# EasyEDA Pro project display_adapter_v3.epro

# Schematic Schematic1
Board Name: Board1; Create Date: 2025-01-31; Page Name: P1; Project Name: New Project_2025-01-31_11-25-02; Schematic Name: Schematic1; Update Date: 2025-01-31; Company: EasyEDA.com; Page Size: A4; Version: V1.0
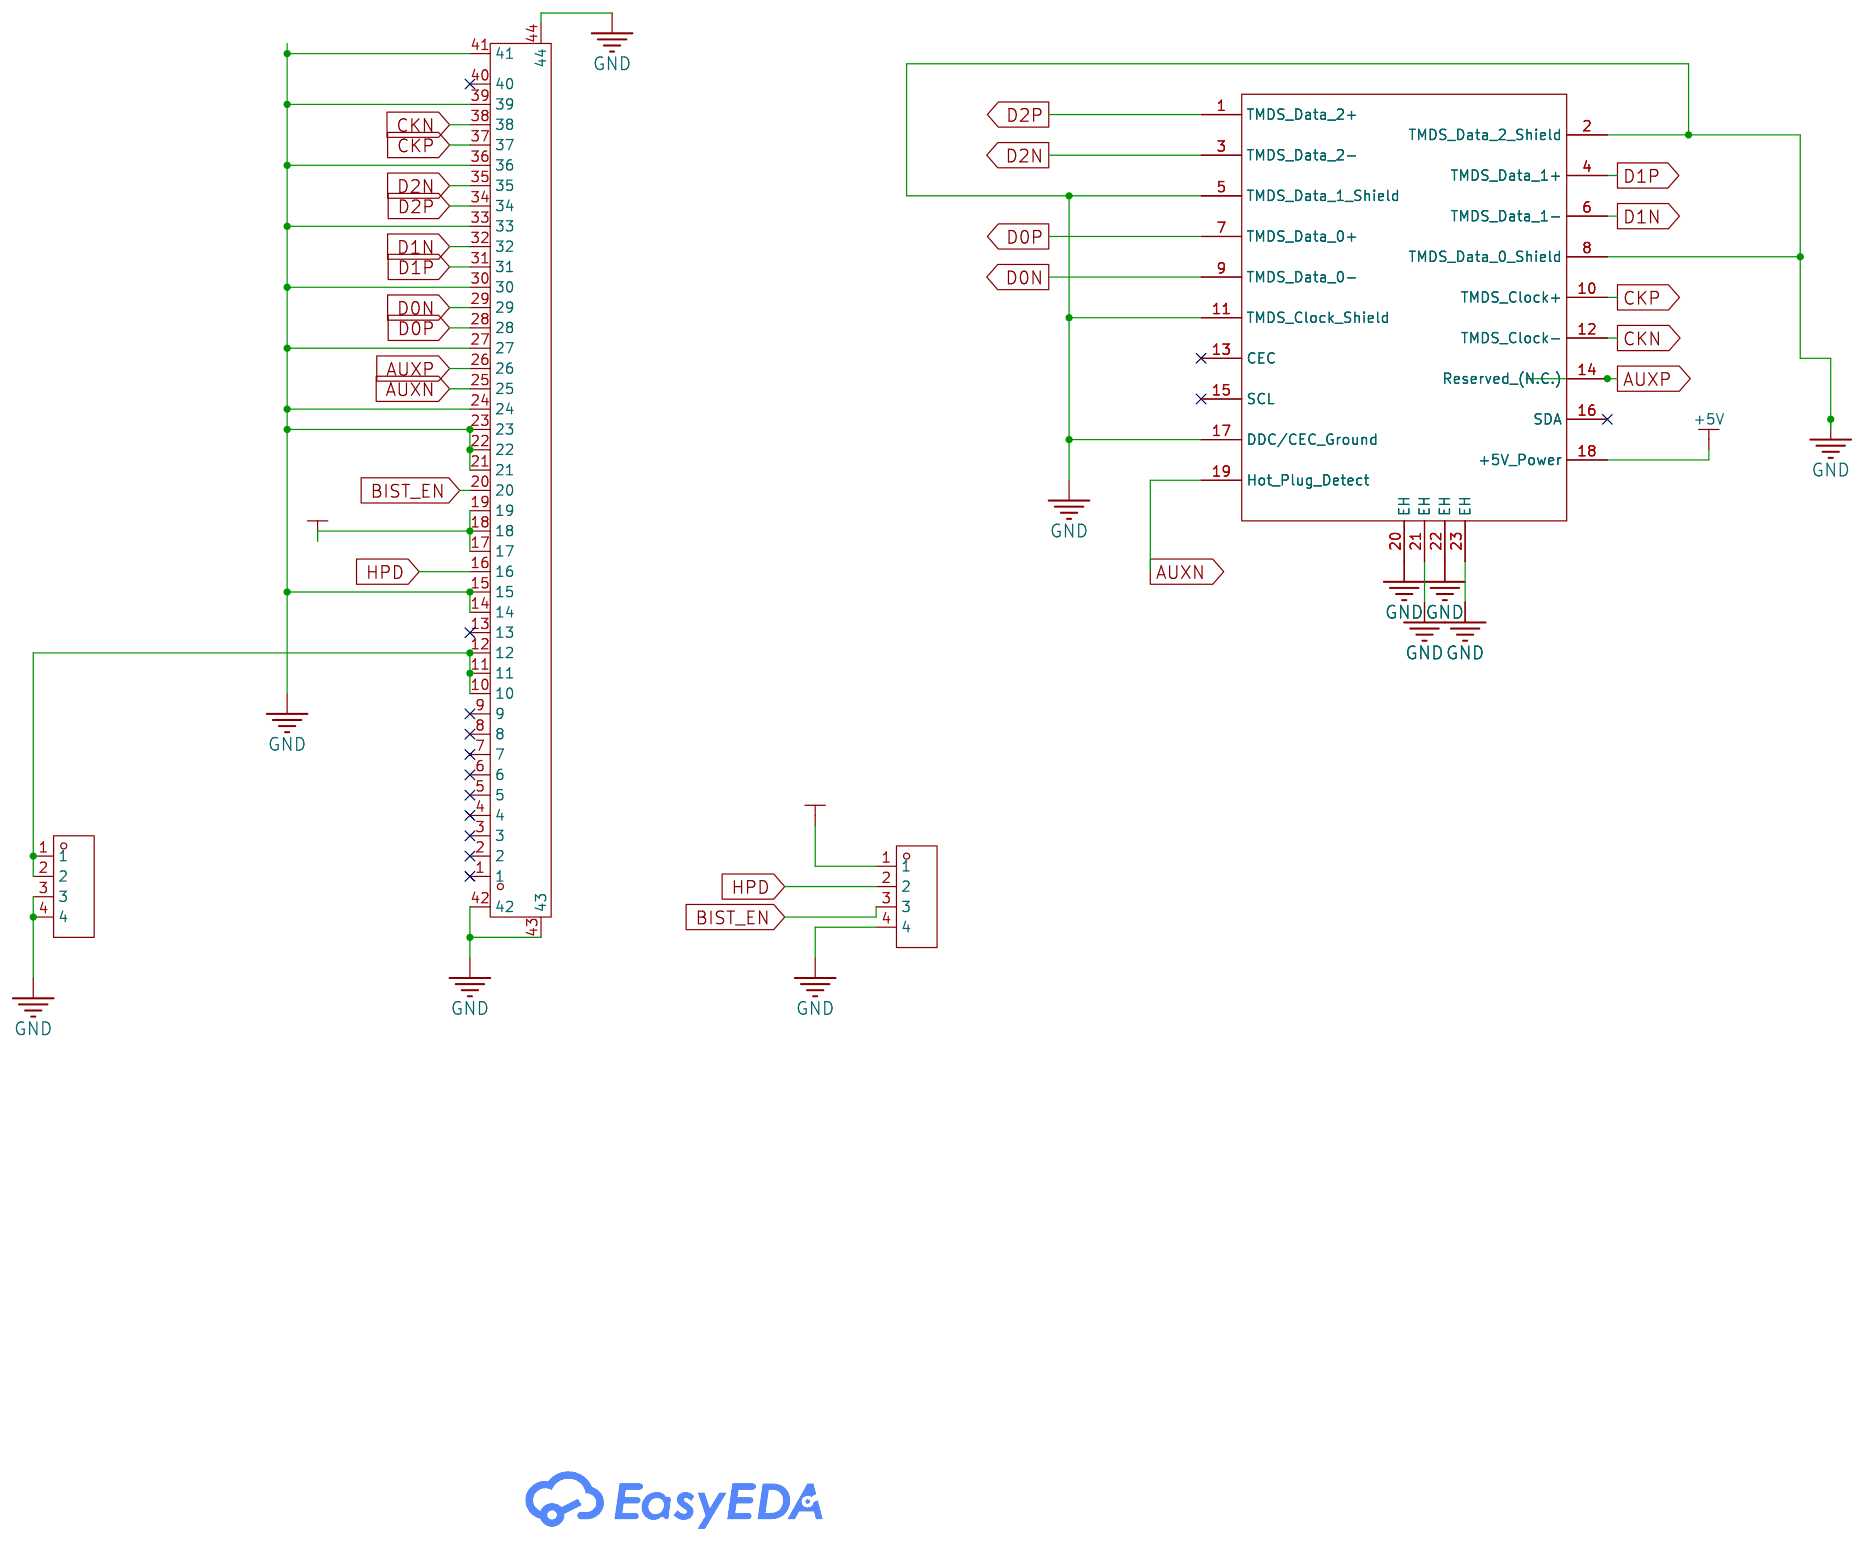
[diagram p0: schematic sheet]

## Parts
CN1  20455-040E-76  [CONN-SMD_40P-P-0.50_20455-040E-76]
CN2  HYC109-HDMIA19-160  [HDMI-SMD_HYC109-HDMIA19-160]
H1  PZ254V-11-04P  [HDR-TH_4P-P2.54-V-M]
H2  PZ254V-11-04P  [HDR-TH_4P-P2.54-V-M]

## Library data of the parts
CN1 = 20455-040E-76: Locking Feature:- Contact Type:Contact,Top Number of Contacts:40P Pitch:0.5mm Mounting Type:Horizontal attachment FFC, FCB Thickness:- FFC, FCB Thickness:- Height Above Board:1mm Contact Material:Phosphor Bronze Contact Plating:Gold Operating Temperature:; LCSC Part Name: 间距:0.5mm P数:40P 上接; Supplier Part: C5160883; Manufacturer: I-PEX(第一精工); Supplier Footprint: SMD,P=0.5mm,卧贴; JLCPCB Part Class: Extended Part; Datasheet: https://atta.szlcsc.com/upload/public/pdf/source/20240130/EF5FF667CA12454350B99650AB73E6AF.pdf; Supplier: LCSC; Contact Type: Contact,Top; Number of Contacts: 40P; Pitch: 0.5mm; Mounting Type: Horizontal attachment; Height Above Board: 1mm; Contact Material: Phosphor Bronze; Contact Plating: Gold; Operating Temperature: -40℃~+85℃
CN2 = HYC109-HDMIA19-160: Connector Type:HDMI-A Gender:公 Number of Pins:19P Mounting Style:夹板 Current Rating (Max):0.5A Rated Voltage (Max):40V Operating Temperature Range:-25℃~+85℃ Operating Temperature Range:-25℃~+85℃; Supplier Part: C711355; Manufacturer: 华宇创; Supplier Footprint: SMD; JLCPCB Part Class: Extended Part; Datasheet: https://atta.szlcsc.com/upload/public/pdf/source/20200812/C711355_A848759657FFB518783CC8260B9E2C54.pdf; Supplier: LCSC; Connector Type: HDMI-A; Gender: 公; Number of Pins: 19P; Mounting Style: 夹板; Current Rating (Max): 0.5A; Rated Voltage (Max): 40V; Operating Temperature Range: -25℃~+85℃
H1 H2 = PZ254V-11-04P: Pin Structure:1x4P Pitch:2.54mm Row Spacing:- Circluar Pins/Square Pins:Square Pins Mounting Type:Straight Number of Rows:Plugin Number of Pins:4P Current Rating (Max):3A Voltage Rating (Max):250V Length of Mating Pin:6mm Insulation Height:2.5mm Length of; LCSC Part Name: 间距:2.54mm 1x4P 直插 方针; Supplier Part: C2691448; Manufacturer: XFCN(兴飞); Supplier Footprint: 插件,P=2.54mm; JLCPCB Part Class: Extended Part; Datasheet: https://atta.szlcsc.com/upload/public/pdf/source/20200309/C492403_F9F19131791D08044AD4F84F8E751A34.pdf; Supplier: LCSC; Pin Structure: 1x4P; Pitch: 2.54mm; Circluar Pins/Square Pins: Square Pins; Mounting Type: Straight; Number of Rows: Plugin; Number of Pins: 4P; Current Rating (Max): 3A; Voltage Rating (Max): 250V; Length of Mating Pin: 6mm; Insulation Height: 2.5mm; Length of End Connection Pin: 3mm; Operating Temperature Range: -40℃~+105℃; Color: Black

## Nets
+3.3V: CN1.17 CN1.18 CN1.19 H2.1
+5V: CN2.18(+5V Power)
GND: CN1.14 CN1.15 CN1.21 CN1.22 CN1.23 CN1.24 CN1.27 CN1.30 CN1.33 CN1.36 CN1.39 CN1.41 CN1.42 CN1.43 CN1.44 CN2.2(TMDS Data 2 Shield) CN2.5(TMDS Data 1 Shield) CN2.8(TMDS Data 0 Shield) CN2.11(TMDS Clock Shield) CN2.17(DDC/CEC Ground) CN2.20(EH) CN2.21(EH) CN2.22(EH) CN2.23(EH) H1.3 H1.4 H2.4
AUXN: CN1.25 CN2.19(Hot Plug Detect)
AUXP: CN1.26 CN2.14(Reserved (N.C.))
BIST_EN: CN1.20 H2.3
CKN: CN1.38 CN2.12(TMDS Clock-)
CKP: CN1.37 CN2.10(TMDS Clock+)
D0N: CN1.29 CN2.9(TMDS Data 0-)
D0P: CN1.28 CN2.7(TMDS Data 0+)
D1N: CN1.32 CN2.6(TMDS Data 1-)
D1P: CN1.31 CN2.4(TMDS Data 1+)
D2N: CN1.35 CN2.3(TMDS Data 2-)
D2P: CN1.34 CN2.1(TMDS Data 2+)
HPD: CN1.16 H2.2
$1N962: CN1.10 CN1.11 CN1.12 H1.1 H1.2

Not connected (* = marked no-connect by the designer): CN1 1* 2* 3* 4* 5* 6* 7* 8* 9* 13* 40*; CN2 13(CEC)* 15(SCL)* 16(SDA)*

# Board PCB1
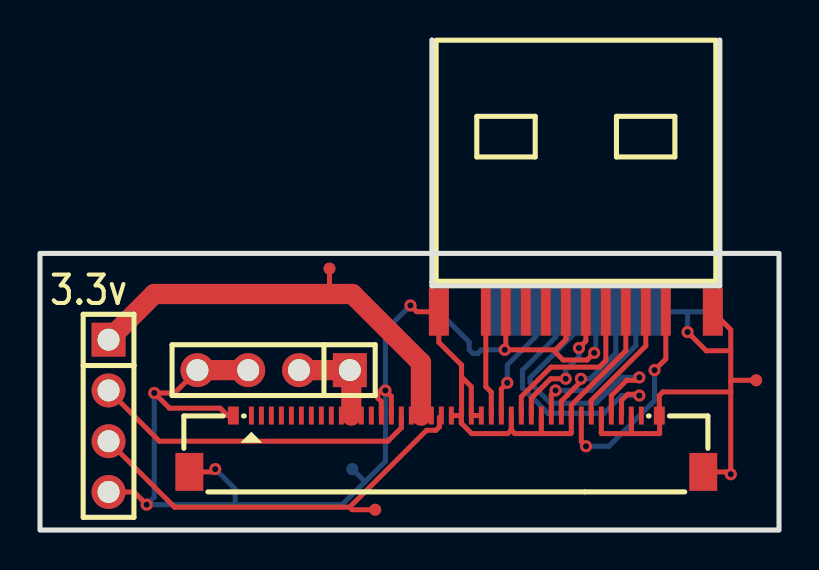
[diagram p1: board, top side]
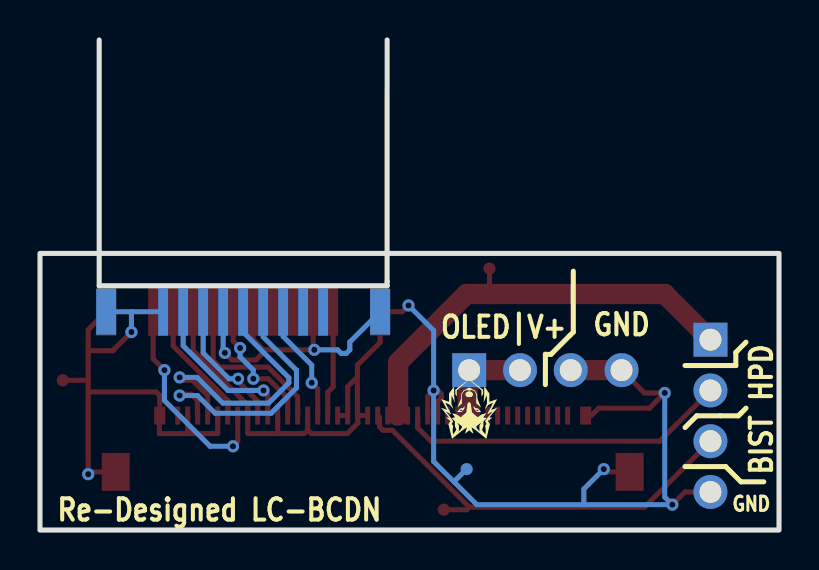
[diagram p2: board, bottom side, seen from below]

Outline 36.96 x 24.52 mm; copper layers: Top Layer, Bottom Layer. Coordinates in mm from the lower left corner of the outline.
Outline path: rectangle 0,13.84 36.96,0
Stack: Top Layer 0.035mm / Dielectric1 1.51mm FR4 er 4.5 / Bottom Layer 0.035mm

## Design rules (mm)
template: JLCPCB Capability(Two Layers Board)
spacing copperThickness1oz (default): track to track 0.102, other pairs 0.152 to 0.3
spacing copperThickness2oz: track to track 0.203, other pairs 0.152 to 0.3
track width copperThickness1oz (default): min 0.127, default 0.254, max 2.54
track width copperThickness2oz: min 0.203, default 0.254, max 2.54
differential pair differentialPair (default): width min 0.127, default 0.254, max 2.54; gap min 0.152, default 0.152
via viaSize (default): diameter min 0.5, default 0.61, max 10; hole min 0.3, default 0.305, max 6.3

## Placement (name value [footprint] x y rotation side)
CN1  20455-040E-76  [CONN-SMD_40P-P-0.50_20455-040E-76]  20.32 4.32 0 top
CN2  HYC109-HDMIA19-160  [HDMI-SMD_HYC109-HDMIA19-160]  26.8 10.92 180 top
H1  PZ254V-11-04P  [HDR-TH_4P-P2.54-V-M]  11.68 8 180 top
H2  PZ254V-11-04P  [HDR-TH_4P-P2.54-V-M]  3.43 5.72 270 top
NOREF  -  [Pad_e748]  16.76 1.02 0 top
NOREF#2  -  [Pad_e739]  35.81 7.49 0 top
NOREF#3  -  [Pad_e557]  15.62 3.05 0 top
NOREF#4  -  [Pad_e545]  14.48 13.08 0 top

## Footprints (pads in the part's own frame, mm; a bottom-side part is the same pattern mirrored in y, then rotated)
CONN-SMD_40P-P-0.50_20455-040E-76
  rect 0.25x0.9 smd: 1(-9.75,1.41) 2(-9.25,1.41) 3(-8.75,1.41) 4(-8.25,1.41) 5(-7.75,1.41) 6(-7.25,1.41) 7(-6.75,1.41) 8(-6.25,1.41) 9(-5.75,1.41) 10(-5.25,1.41) 11(-4.75,1.41) 12(-4.25,1.41) 13(-3.75,1.41) 14(-3.25,1.41) 15(-2.75,1.41) 16(-2.25,1.41) 17(-1.75,1.41) 18(-1.25,1.41) 19(-0.75,1.41) 20(-0.25,1.41) 21(0.25,1.41) 22(0.75,1.41) 23(1.25,1.41) 24(1.75,1.41) 25(2.25,1.41) 26(2.75,1.41) 27(3.25,1.41) 28(3.75,1.41) 29(4.25,1.41) 30(4.75,1.41) 31(5.25,1.41) 32(5.75,1.41) 33(6.25,1.41) 34(6.75,1.41) 35(7.25,1.41) 36(7.75,1.41) 37(8.25,1.41) 38(8.75,1.41) 39(9.25,1.41) 40(9.75,1.41)
  rect 0.55x0.9 smd: 41(10.65,1.41) 42(-10.65,1.41)
  rect 1.4x1.9 smd: 43(-12.85,-1.41) 44(12.85,-1.41)
HDMI-SMD_HYC109-HDMIA19-160
  rect 0.5x2.4 smd: 1(-4.5,0) 3(-3.5,0) 5(-2.5,0) 7(-1.5,0) 9(-0.5,0) 11(0.5,0) 13(1.5,0) 15(2.5,0) 17(3.5,0) 19(4.5,0)
  rect 0.5x2.4 smd far side: 2(-4,0) 4(-3,0) 6(-2,0) 8(-1,0) 10(0,0) 12(1,0) 14(2,0) 16(3,0) 18(4,0)
  rect 1x2.4 smd: 20(-6.85,0) 21(6.85,0)
  rect 1x2.3 smd far side: 22(-6.85,0) 23(6.85,0)
HDR-TH_4P-P2.54-V-M
  rect 1.7x1.7 hole 1.1: 1(-3.81,0)
  round 1.7 hole 1.1: 2(-1.27,0) 3(1.27,0) 4(3.81,0)
Pad_e545
  round 0.61 smd: TP1(0,0)
Pad_e557
  round 0.61 smd far side: TP4(0,0)
Pad_e739
  round 0.61 smd: TP5(0,0)
Pad_e748
  round 0.61 smd: TP6(0,0)

## Nets
As in the schematic, except:
+3.3V: CN1.17 CN1.18 CN1.19 H2.1 NOREF#4.TP1
GND: CN1.14 CN1.15 CN1.21 CN1.22 CN1.23 CN1.24 CN1.27 CN1.30 CN1.33 CN1.36 CN1.39 CN1.41 CN1.42 CN1.43 CN1.44 CN2.2 CN2.5 CN2.8 CN2.11 CN2.17 CN2.20 CN2.21 CN2.22 CN2.23 H1.3 H1.4 H2.4 NOREF#2.TP5 NOREF#3.TP4
BIST_EN: CN1.20 H2.3 NOREF.TP6

Pads without a net: CN1 1 2 3 4 5 6 7 8 9 13 40; CN2 13 15 16

## Via types
v1: diameter 0.61, hole 0.305, Top Layer to Bottom Layer, 18 vias

## Routing (per net, layer and track width the routed paths; a pad name or vN(x,y) marks a point on that pad's centre or on a via; arc(x,y) is an arc through that point)
+3.3V: length 22.9
  Top Layer w0.254: CN1.17 CN1.18 CN1.19 ; 14.5,11.81 14.48,11.84 NOREF#4.TP1
  Top Layer w1.016: H2.1 5.71,11.81 15.62,11.81 19.05,8.38 19.05,5.75 CN1.18
GND: length 115
  Top Layer w0.254: H2.4 4.7,1.91 v1(5.33,1.27) ; v1(8.76,3.05) 8.62,2.91 7.47,2.91 ; 25.04,4.83 23.75,4.83 23.57,5.01 ; 25.04,4.83 25.07,4.85 CN1.30 ; 25.04,4.83 26.54,4.83 26.57,4.85 CN1.33 26.57,6.25 29.3,8.98 CN2.5 ; v1(32.38,9.91) 33.32,8.97 34.54,8.97 ; CN2.17 23.3,9.07 v1(23.24,9.02) 25.78,9.02 ; 23.57,5.01 23.39,4.83 21.59,4.83 21.07,5.35 CN1.22 ; 23.57,5.01 CN1.27 ; CN1.42 9.38,5.73 9.02,6.1 6.48,6.1 v1(5.71,6.86) 6.73,6.86 H1.4 ; 21.08,7.66 21.08,8.26 19.95,9.39 CN2.21 18.84,10.92 v1(18.53,11.24) ; 21.08,7.66 21.08,5.74 CN1.22 ; 21.08,7.66 21.57,7.17 CN1.23 CN1.24 ; 25.78,9.02 25.78,8.89 26.16,8.51 27.36,8.51 v1(27.71,8.86) ; 25.78,9.02 26.3,9.53 CN2.11 ; 34.54,6.9 34.53,6.91 31.15,6.91 30.97,6.73 CN1.41 30.99,5.71 30.99,4.83 29.57,4.83 ; 34.54,6.9 v1(34.54,2.79) 34.43,2.91 33.17,2.91 ; 34.54,6.9 34.54,7.43 ; 29.57,4.83 29.57,5.73 CN1.39 ; 29.57,4.83 28.09,4.83 28.07,4.84 CN1.36 ; 34.54,8.97 34.54,10.03 CN2.20 ; 34.54,8.97 34.54,7.43 ; 34.54,7.43 34.6,7.49 NOREF#2.TP5 ; CN1.22 CN1.21 ; CN1.15 17.57,6.69 v1(17.27,6.98) 17.05,6.98 16.89,6.83 16.89,6.6 17.07,6.43 CN1.14
  Top Layer w1.016: H1.3 H1.4
  Bottom Layer w0.254: v1(5.71,6.86) 5.71,1.65 v1(5.33,1.27) 9.76,1.27 ; v1(27.71,8.86) 27.8,8.95 CN2.8 ; v1(32.38,9.91) 32.38,10.87 32.34,10.92 ; 9.76,1.27 15.11,1.27 16.23,2.39 ; 9.76,1.27 9.76,2.05 v1(8.76,3.05) ; 16.23,2.39 16.23,2.44 NOREF#3.TP4 ; 16.23,2.39 17.27,3.43 v1(17.27,6.98) 17.27,9.98 v1(18.53,11.24) ; CN2.2 32.34,10.92 ; 32.34,10.92 CN2.20 ; v1(23.24,9.02) 22.08,9.02 21.9,8.84 21.64,8.84 21.46,9.02 21.46,9.41 CN2.21
AUXN: length 5.3
  Top Layer w0.254: CN2.19 22.3,7.17 22.57,6.89 CN1.25
AUXP: length 5.9
  Top Layer w0.254: v1(23.37,7.37) 23.07,7.07 CN1.26
  Bottom Layer w0.254: CN2.14 24.8,9.68 23.37,8.26 v1(23.37,7.37)
BIST_EN: length 21.5
  Top Layer w0.254: 15.48,1.14 19.33,4.99 19.8,4.99 19.97,5.16 19.97,5.63 CN1.20 ; 15.48,1.14 6.73,1.14 H2.3 ; 15.48,1.14 15.61,1.02 NOREF.TP6
CKN: length 13
  Top Layer w0.254: CN1.38 29.08,5.74 29.08,6.49 29.39,6.79 29.91,6.79 v1(29.97,6.73)
  Bottom Layer w0.254: v1(29.97,6.73) 29.08,6.73 28.19,5.84 25.4,5.84 24.13,7.11 24.13,8 25.8,9.67 CN2.12
CKP: length 13.7
  Top Layer w0.254: CN1.37 28.57,6.73 29.34,7.49 29.83,7.49 v1(29.97,7.64)
  Bottom Layer w0.254: CN2.10 26.8,9.91 24.51,7.62 24.51,7.37 25.53,6.35 27.81,6.35 29.1,7.64 v1(29.97,7.64)
D0N: length 6.8
  Top Layer w0.254: v1(26.29,7.57) 25.54,7.57 24.57,6.6 CN1.29 ; v1(26.95,9.11) 27.3,9.46 CN2.9
  Bottom Layer w0.254: v1(26.95,9.11) 26.95,8.66 26.29,8 v1(26.29,7.57)
D0P: length 8.4
  Top Layer w0.254: CN1.28 24.07,6.67 25.55,8.15 27.96,8.15 28.3,8.48 CN2.7
D1N: length 6.6
  Top Layer w0.254: CN1.32 26.07,6.45 26.36,6.74 26.36,6.75 27.05,7.43 v1(27.05,7.57)
  Bottom Layer w0.254: CN2.6 28.8,8.86 27.51,7.57 v1(27.05,7.57)
D1P: length 8
  Top Layer w0.254: v1(25.78,6.98) 25.57,6.77 CN1.31
  Bottom Layer w0.254: CN2.4 29.8,9.22 27.56,6.98 v1(25.78,6.98)
D2N: length 6.3
  Top Layer w0.254: CN2.3 30.3,9.22 27.56,6.48 27.56,5.74 CN1.35
D2P: length 10.7
  Top Layer w0.254: CN1.34 27.07,4.43 v1(27.3,4.19) ; CN2.1 31.3,8.56 v1(30.73,8)
  Bottom Layer w0.254: v1(30.73,8) 30.73,6.48 28.45,4.19 v1(27.3,4.19)
HPD: length 16.6
  Top Layer w0.254: CN1.16 18.07,5.12 17.4,4.45 5.97,4.45 H2.2
$1N962: length 5.8
  Top Layer w0.254: CN1.12 CN1.11 CN1.10
  Top Layer w1.016: H1.2 H1.1 15.57,7.93 CN1.11

## Text on the board
Bottom Silkscreen Layer: GND | HPD | BIST | OLED|V+ | Re-Designed LC-BCDN
Top Silkscreen Layer: 3.3v
